# Altium project PCB_Project.PrjPcb (part 3 of 3)

## Sheet MCU2.SchDoc
size A3; SheetNumber: 8; SheetTotal: 8
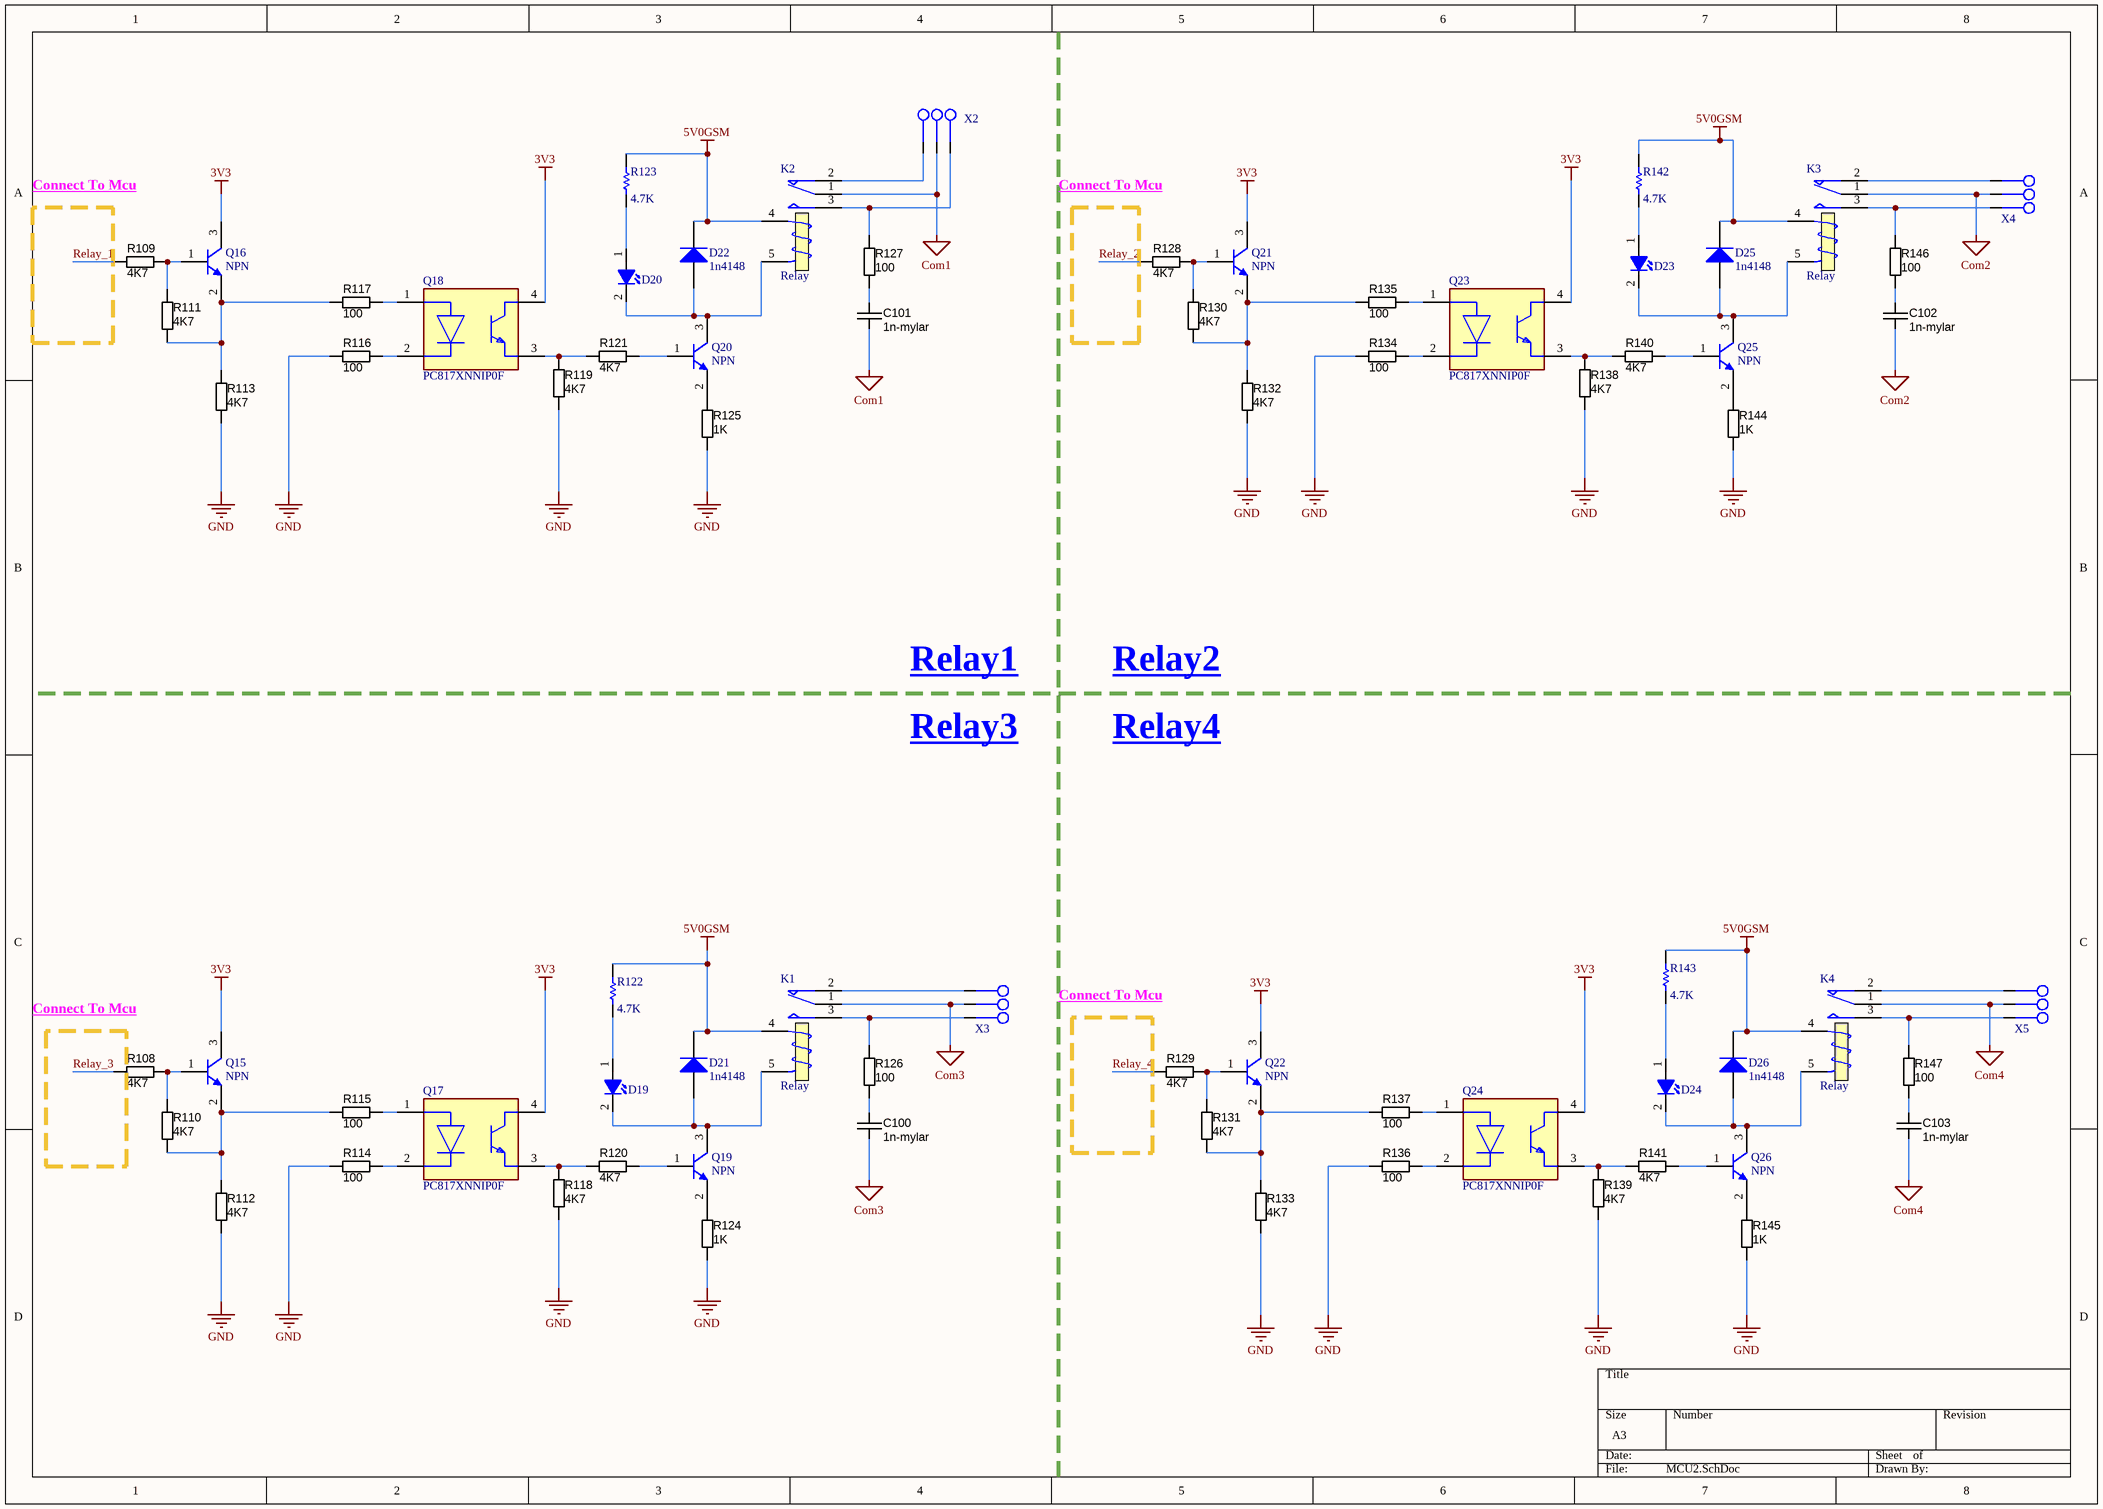
[diagram p8: MCU2.SchDoc]

### Parts
C100  value 1n-mylar  [C_PLY_13X5]  (hidden comment: approved sub OK)
C101  value 1n-mylar  [C_PLY_13X5]  (hidden comment: approved sub OK)
C102  value 1n-mylar  [C_PLY_13X5]  (hidden comment: approved sub OK)
C103  value 1n-mylar  [C_PLY_13X5]  (hidden comment: approved sub OK)
D19  LED THD 5mm  [LED5MM_RED]  (value not drawn)
D20  LED THD 5mm  [LED5MM_RED]  (value not drawn)
D21  1n4148  [d_sod80]
D22  1n4148  [d_sod80]
D23  LED THD 5mm  [LED5MM_RED]  (value not drawn)
D24  LED THD 5mm  [LED5MM_RED]  (value not drawn)
D25  1n4148  [d_sod80]
D26  1n4148  [d_sod80]
K1  Relay  [REL_SPDT_5_2216]
K2  Relay  [REL_SPDT_5_2216]
K3  Relay  [REL_SPDT_5_2216]
K4  Relay  [REL_SPDT_5_2216]
Q15  NPN  [SOT23-3]
Q16  NPN  [SOT23-3]
Q17  PC817XNNIP0F  [FP-PC817XNNIP0F-MFG]
Q18  PC817XNNIP0F  [FP-PC817XNNIP0F-MFG]
Q19  NPN  [SOT23-3]
Q20  NPN  [SOT23-3]
Q21  NPN  [SOT23-3]
Q22  NPN  [SOT23-3]
Q23  PC817XNNIP0F  [FP-PC817XNNIP0F-MFG]
Q24  PC817XNNIP0F  [FP-PC817XNNIP0F-MFG]
Q25  NPN  [SOT23-3]
Q26  NPN  [SOT23-3]
R108  value 4K7  [RESC1608X55N]  (hidden comment: Thick Film)
R109  value 4K7  [RESC1608X55N]  (hidden comment: Thick Film)
R110  value 4K7  [RESC1608X55N]  (hidden comment: Thick Film)
R111  value 4K7  [RESC1608X55N]  (hidden comment: Thick Film)
R112  value 4K7  [RESC1608X55N]  (hidden comment: Thick Film)
R113  value 4K7  [RESC1608X55N]  (hidden comment: Thick Film)
R114  value 100  [RESC1608X55N]  (hidden comment: Thick Film)
R115  value 100  [RESC1608X55N]  (hidden comment: Thick Film)
R116  value 100  [RESC1608X55N]  (hidden comment: Thick Film)
R117  value 100  [RESC1608X55N]  (hidden comment: Thick Film)
R118  value 4K7  [RESC1608X55N]  (hidden comment: Thick Film)
R119  value 4K7  [RESC1608X55N]  (hidden comment: Thick Film)
R120  value 4K7  [RESC1608X55N]  (hidden comment: Thick Film)
R121  value 4K7  [RESC1608X55N]  (hidden comment: Thick Film)
R122  value 4.7K  [0603]  (hidden comment: Res1)
R123  value 4.7K  [0603]  (hidden comment: Res1)
R124  value 1K  [RESC1608X55N]  (hidden comment: Thick Film)
R125  value 1K  [RESC1608X55N]  (hidden comment: Thick Film)
R126  value 100  [R2512]  (hidden comment: Thick Film)
R127  value 100  [R2512]  (hidden comment: Thick Film)
R128  value 4K7  [RESC1608X55N]  (hidden comment: Thick Film)
R129  value 4K7  [RESC1608X55N]  (hidden comment: Thick Film)
R130  value 4K7  [RESC1608X55N]  (hidden comment: Thick Film)
R131  value 4K7  [RESC1608X55N]  (hidden comment: Thick Film)
R132  value 4K7  [RESC1608X55N]  (hidden comment: Thick Film)
R133  value 4K7  [RESC1608X55N]  (hidden comment: Thick Film)
R134  value 100  [RESC1608X55N]  (hidden comment: Thick Film)
R135  value 100  [RESC1608X55N]  (hidden comment: Thick Film)
R136  value 100  [RESC1608X55N]  (hidden comment: Thick Film)
R137  value 100  [RESC1608X55N]  (hidden comment: Thick Film)
R138  value 4K7  [RESC1608X55N]  (hidden comment: Thick Film)
R139  value 4K7  [RESC1608X55N]  (hidden comment: Thick Film)
R140  value 4K7  [RESC1608X55N]  (hidden comment: Thick Film)
R141  value 4K7  [RESC1608X55N]  (hidden comment: Thick Film)
R142  value 4.7K  [0603]  (hidden comment: Res1)
R143  value 4.7K  [0603]  (hidden comment: Res1)
R144  value 1K  [RESC1608X55N]  (hidden comment: Thick Film)
R145  value 1K  [RESC1608X55N]  (hidden comment: Thick Film)
R146  value 100  [R2512]  (hidden comment: Thick Film)
R147  value 100  [R2512]  (hidden comment: Thick Film)
X2  Phoenix MKDSN 03  [CON_MSTBA03]  (value not drawn)
X3  Phoenix MKDSN 03  [CON_MSTBA03]  (value not drawn)
X4  Phoenix MKDSN 03  [CON_MSTBA03]  (value not drawn)
X5  Phoenix MKDSN 03  [CON_MSTBA03]  (value not drawn)

### Nets
3V3: Q15.3(C) Q16.3(C) Q17.4(C) Q18.4(C) Q21.3(C) Q22.3(C) Q23.4(C) Q24.4(C)
5V0GSM: D21.2(K) D22.2(K) D25.2(K) D26.2(K) K1.4(T1) K2.4(T1) K3.4(T1) K4.4(T1) R122.2 R123.2 R142.2 R143.2
Com1: C101.2 K2.1(COM) X2.2
Com2: C102.2 K3.1(COM) X4.2
Com3: C100.2 K1.1(COM) X3.2
Com4: C103.2 K4.1(COM) X5.2
GND: R112.1 R113.1 R114.1 R116.1 R118.1 R119.1 R124.2 R125.2 R132.1 R133.1 R134.1 R136.1 R138.1 R139.1 R144.2 R145.2
Relay_1: R109.1
Relay_2: R128.1
Relay_3: R108.1
Relay_4: R129.1
NetC100_1: C100.1 R126.1
NetC101_1: C101.1 R127.1
NetC102_1: C102.1 R146.1
NetC103_1: C103.1 R147.1
NetD19_1: D19.1(ANODE) R122.1
NetD19_2: D19.2(CATHODE) D21.1(A) K1.5(T2) Q19.3(C)
NetD20_1: D20.1(ANODE) R123.1
NetD20_2: D20.2(CATHODE) D22.1(A) K2.5(T2) Q20.3(C)
NetD23_1: D23.1(ANODE) R142.1
NetD23_2: D23.2(CATHODE) D25.1(A) K3.5(T2) Q25.3(C)
NetD24_1: D24.1(ANODE) R143.1
NetD24_2: D24.2(CATHODE) D26.1(A) K4.5(T2) Q26.3(C)
NetK1_2: K1.2(NC) X3.3
NetK1_3: K1.3(NO) R126.2 X3.1
NetK2_2: K2.2(NC) X2.3
NetK2_3: K2.3(NO) R127.2 X2.1
NetK3_2: K3.2(NC) X4.3
NetK3_3: K3.3(NO) R146.2 X4.1
NetK4_2: K4.2(NC) X5.3
NetK4_3: K4.3(NO) R147.2 X5.1
NetQ15_1: Q15.1(B) R108.2 R110.2
NetQ15_2: Q15.2(E) R110.1 R112.2 R115.1
NetQ16_1: Q16.1(B) R109.2 R111.2
NetQ16_2: Q16.2(E) R111.1 R113.2 R117.1
NetQ17_1: Q17.1(A) R115.2
NetQ17_2: Q17.2(C) R114.2
NetQ17_3: Q17.3(E) R118.2 R120.1
NetQ18_1: Q18.1(A) R117.2
NetQ18_2: Q18.2(C) R116.2
NetQ18_3: Q18.3(E) R119.2 R121.1
NetQ19_1: Q19.1(B) R120.2
NetQ19_2: Q19.2(E) R124.1
NetQ20_1: Q20.1(B) R121.2
NetQ20_2: Q20.2(E) R125.1
NetQ21_1: Q21.1(B) R128.2 R130.2
NetQ21_2: Q21.2(E) R130.1 R132.2 R135.1
NetQ22_1: Q22.1(B) R129.2 R131.2
NetQ22_2: Q22.2(E) R131.1 R133.2 R137.1
NetQ23_1: Q23.1(A) R135.2
NetQ23_2: Q23.2(C) R134.2
NetQ23_3: Q23.3(E) R138.2 R140.1
NetQ24_1: Q24.1(A) R137.2
NetQ24_2: Q24.2(C) R136.2
NetQ24_3: Q24.3(E) R139.2 R141.1
NetQ25_1: Q25.1(B) R140.2
NetQ25_2: Q25.2(E) R144.1
NetQ26_1: Q26.1(B) R141.2
NetQ26_2: Q26.2(E) R145.1

### Notes on the sheet
- Connect To Mcu
- Relay1
- Relay2
- Relay3
- Relay4

### Library data of the parts
C100-C103 = CAPC_100n_0603_X7R_50V_10%: Capacitor SMD Cer 1nF 10% 50V X7R 0603; Manufacturer 1: AVX Corporation; Manufacturer Part Number 1: 06035C104KAT2A; Ratings: 50V; X7R; Material: ceramic; SCDType: spec; Manufacturer 2: TDK Corporation; Manufacturer Part Number 2: C1608X7R1H104K; Package / Case: 0603 (1608 Metric); Tolerance: ±10%; Supplier 1: Digi-Key; Supplier Part Number 1: 478-5052-1-ND; ComponentLink1URL: http://www.avx.com/docs/Catalogs/cx7r.pdf; ComponentLink1Description: http://www.avx.com/docs/Catalogs/cx7r.pdf; Supplier 2: Digi-Key; Supplier Part Number 2: 445-1314-1-ND; ComponentLink2URL: http://product.tdk.com/capacitor/mlcc/en/documents/mlcc_commercial_general_en.pdf; ComponentLink2Description: http://product.tdk.com/capacitor/mlcc/en/documents/mlcc_commercial_general_en.pdf
D21 D22 D25 D26 = Diode: Default Diode; Published: 8-Jun-2000; LatestRevisionDate: 17-Jul-2002; LatestRevisionNote: Re-released for DXP Platform.; PackageVersion: Sep-1996; PackageReference: SMC; Publisher: Altium Limited; PackageDescription: DO-214-AB/SMC; 2 C-Bend Leads; Body 7.9 x 5.9 mm, inc. leads (LxW); Code_JEDEC: DO-214-AB
K1-K4 = Relay: SPDT Relay; Published: 8-Jun-2000; LatestRevisionDate: 17-Jul-2002; LatestRevisionNote: Re-released for DXP Platform.; PackageReference: MODULE5B; Publisher: Altium Limited
Q15 Q16 Q19-Q22 Q25 Q26 = NPN: NPN Bipolar Transistor; Published: 8-Jun-2000; LatestRevisionDate: 17-Jul-2002; LatestRevisionNote: Re-released for DXP Platform.; PackageReference: TO-226-AA; Publisher: Altium Limited; PackageDescription: TO, Flat Index; 3 In-Line, Axial Leads; Body Dia. 4.8mm; Leads 0.55 x 0.51 mm (max); Code_JEDEC: TO-226-AA
Q17 Q18 Q23 Q24 = CMP-65434-000005-1: OPTOISOLATOR 5KV TRANS 4SMD; Reverse Breakdown Voltage: 6V; Output Current per Channel: 30mA; Power Dissipation: 200mW; Collector-emitter Voltage-Max: 200mV; Max Output Voltage: 80V; Input Current: 50mA; Forward Voltage: 1.4V; Fall Time: 18000ns; Number of Elements: 1; Input Type: DC; Packaging: Tape and Reel; RoHS Compliant: Yes; Contact Plating: Copper; Min Operating Temperature: -30°C; Collector Emitter Saturation Voltage: 200mV; Max Input Current: 50mA; Radiation Hardening: No; Max Collector Current: 50mA; Case/Package: SMD/SMT; Mount: Surface Mount; Output Voltage: 80V; Forward Current: 50mA; Max Power Dissipation: 200mW; Collector Emitter Voltage (VCEO): 80V; Number of Channels: 1; Rise Time: 18000ns; Isolation Voltage: 5kV; Number of Pins: 4; Lead Free: Lead Free; Package Quantity: 2000; Isolation Voltage-Max: 5kV; Max Operating Temperature: 100°C
R108-R113 R118-R121 R124-R133 R138-R141 R144-R147 = RES_4K7_0603_5%: Resistor SMD chip 4.7k Ohm 0.1W 5% 0603; Manufacturer 1: Vishay/Dale; Manufacturer Part Number 1: CRCW06034K70JNEA; Ratings: 1/10 W; SCDType: spec; Package / Case: 0603 (1608 metric); Tolerance: ±5%; Material: Thick Film; Supplier 1: Digi-Key; Supplier Part Number 1: 541-4.7KGCT-ND
R114-R117 R134-R137 = RES_4K7_0603_5%: Resistor SMD chip 100 Ohm 0.1W 5% 0603; Manufacturer 1: Vishay/Dale; Manufacturer Part Number 1: CRCW06034K70JNEA; Ratings: 1/10 W; SCDType: spec; Package / Case: 0603 (1608 metric); Tolerance: ±5%; Material: Thick Film; Supplier 1: Digi-Key; Supplier Part Number 1: 541-4.7KGCT-ND
R122 R123 R142 R143 = Res1: Resistor; Published: 8-Jun-2000; LatestRevisionDate: 17-Jul-2002; LatestRevisionNote: Re-released for DXP Platform.; PackageReference: AXIAL-0.3; Publisher: Altium Limited; PackageDescription: Axial Device, Thru-Hole; 2 Leads; 0.3 in Pin Spacing
D19 D20 D23 D24 = LED THD 5mm: ComponentLink1Description: Website Smart World; ComponentLink1URL: https://www.smartw.ir/; ComponentLink2Description: Telegram; ComponentLink2URL: https://t.me/altium_smartw; DatasheetVersion: 2021; ComponentLink3Description: Instagram; ComponentLink3URL: https://Instagram.com/smartgw.ir
X2-X5 = Phoenix MKDSN 03: ComponentLink1Description: Website Smart World; ComponentLink1URL: https://www.smartw.ir/; ComponentLink2Description: Telegram; ComponentLink2URL: https://t.me/altium_smartw; ComponentLink3Description: Instagram; ComponentLink3URL: https://Instagram.com/smartgw.ir; DatasheetVersion: 2021

## Nets that join several sheets
1V2: W5500 (C32.1 U5.22), Power (C83.1 C84.1 U9.2 U9.4)
3V3: MCU1 (17 pins), Wifi (8 pins), W5500 (13 pins), MCU3 (28 pins), MC60 (D10.2 D11.2), Power (8 pins), MCU4 (C99.1 HC1.12 R105.2 S5.1), MCU2 (8 pins)
5V0: MCU3 (PUSB1.1 R47.1), Power (D16.2 F2.1)
5V0GSM: MCU3 (J14.3), Power (5 pins), MCU2 (12 pins)
GND: MCU1 (40 pins), Wifi (10 pins), W5500 (37 pins), MCU3 (40 pins), MC60 (58 pins), Power (38 pins), MCU4 (6 pins), MCU2 (16 pins)
GNSS_3V3: MC60 (C52.1 C54.1 R96.1 U8.26), Power (C85.1 C86.1 R100.1 U10.5)
GSM_4V0: MC60 (7 pins), Power (8 pins)
GSM_VRTC: MCU1 (J1.1), MC60 (U8.52)
B8: MCU1 (U1.95), MCU3 (J13.22)
B9: MCU1 (U1.96), MCU3 (J13.23)
C3: MCU1 (U1.18), MCU3 (J13.20)
C13: MCU1 (U1.7), MCU3 (J13.21)
D0: MCU1 (U1.81), MCU3 (J13.13)
D1: MCU1 (U1.82), MCU3 (J13.14)
D5: MCU1 (U1.86), MCU3 (J13.15)
D6: MCU1 (U1.87), MCU3 (J13.16)
D10: MCU1 (U1.57), MCU3 (J13.17)
D11: MCU1 (U1.58), MCU3 (J13.18)
D12: MCU1 (U1.59), MCU3 (J13.19)
E0: MCU1 (U1.97), MCU3 (J13.1)
E1: MCU1 (U1.98), MCU3 (J13.2)
E2: MCU1 (U1.1), MCU3 (J13.3)
E3: MCU1 (U1.2), MCU3 (J13.4)
E4: MCU1 (U1.3), MCU3 (J13.5)
E5: MCU1 (U1.4), MCU3 (J13.6)
E6: MCU1 (U1.5), MCU3 (J13.7)
E11: MCU1 (U1.42), MCU3 (J13.8)
E12: MCU1 (U1.43), MCU3 (J13.9)
E13: MCU1 (U1.44), MCU3 (J13.10)
E14: MCU1 (U1.45), MCU3 (J13.11)
E15: MCU1 (U1.46), MCU3 (J13.12)
ESP_EN: MCU1 (U1.67), Wifi (R22.1)
ESP_RST: MCU1 (U1.64), Wifi (R21.1)
ESP_RX: MCU1 (U1.68), Wifi (U4.21)
ESP_TX: MCU1 (U1.69), Wifi (U4.22)
FS_USB_N: MCU1 (U1.70), MCU3 (R49.2 R51.1)
FS_USB_P: MCU1 (U1.71), MCU3 (R50.2 R52.1)
GNSS_PWR_EN: MC60 (U8.28), Power (R97.1 U10.3)
GSM_1PPS: MCU1 (U1.41), MC60 (Q14.2 R77.1)
GSM_NETLIGHT: MCU1 (U1.40), MC60 (Q12.2 R72.1)
GSM_PWR_KEY: MCU1 (U1.39), MC60 (R68.2)
HC05_RX: MCU1 (U1.47), MCU4 (HC1.2)
HC05_TX: MCU1 (U1.48), MCU4 (HC1.1)
LCD_CLK: MCU1 (U1.89), MCU3 (P1.3)
LCD_CS: MCU1 (U1.88), MCU3 (P1.5)
LCD_DC: MCU1 (U1.84), MCU3 (P1.4)
LCD_MISO: MCU1 (U1.90), MCU3 (P1.7)
LCD_MOSI: MCU1 (U1.91), MCU3 (P1.6)
LCD_RES: MCU1 (U1.85), MCU3 (P1.2)
M60_DTR: MCU1 (U1.23), MC60 (R80.2)
M60_RX: MCU1 (U1.25), MC60 (R81.2)
M60_TX: MCU1 (U1.26), MC60 (R82.2)
MC60_IR: MCU1 (U1.24), MC60 (R79.2)
MCU_NRST: MCU1 (C5.1 R7.2 S1.1 U1.14), MCU3 (J12.2)
Relay_1: MCU1 (U1.63), MCU2 (R109.1)
Relay_2: MCU1 (U1.62), MCU2 (R128.1)
Relay_3: MCU1 (U1.61), MCU2 (R108.1)
Relay_4: MCU1 (U1.60), MCU2 (R129.1)
SDCARD_STATE: MCU1 (U1.77), MCU3 (J10.9 R48.5)
SDIO_CLK: MCU1 (U1.80), MCU3 (J10.5 R48.8)
SDIO_CMD: MCU1 (U1.83), MCU3 (J10.3 R44.6)
SDIO_D0: MCU1 (U1.65), MCU3 (J10.7 R48.7)
SDIO_D1: MCU1 (U1.66), MCU3 (J10.8 R48.6)
SDIO_D2: MCU1 (U1.78), MCU3 (J10.1 R44.8)
SDIO_D3: MCU1 (U1.79), MCU3 (J10.2 R44.7)
SWCLK: MCU1 (U1.76), MCU3 (J12.3)
SWDIO: MCU1 (U1.72), MCU3 (J12.4)
USER_KEY1: MCU1 (U1.36), MCU3 (C48.1 R60.2 S4.1)
USER_KEY2: MCU1 (U1.37), MCU3 (C47.1 R59.2 S3.1)
USER_KEY3: MCU1 (U1.38), MCU3 (C46.1 R58.2 S2.1)
W25Q_CLK: MCU1 (U1.30 U3.6), MCU3 (U7.16)
W25Q_MISO: MCU1 (U1.31 U3.2), MCU3 (U7.12)
W25Q_MOSI: MCU1 (U1.32 U3.5), MCU3 (U7.14)
W5500_CS: MCU1 (U1.51), W5500 (U5.32)
W5500_INT: MCU1 (U1.55), W5500 (U5.36)
W5500_MISO: MCU1 (U1.53), W5500 (U5.34)
W5500_MOSI: MCU1 (U1.54), W5500 (U5.35)
W5500_RST: MCU1 (U1.56), W5500 (R42.1)
W5500_SCK: MCU1 (U1.52), W5500 (U5.33)
XPT2046_CS: MCU1 (U1.34), MCU3 (U7.15)
XPT2046_IRQ: MCU1 (U1.35), MCU3 (R61.2 U7.11)